# Altium schematic sheet 3.SchDoc
size 420 x 297 mm
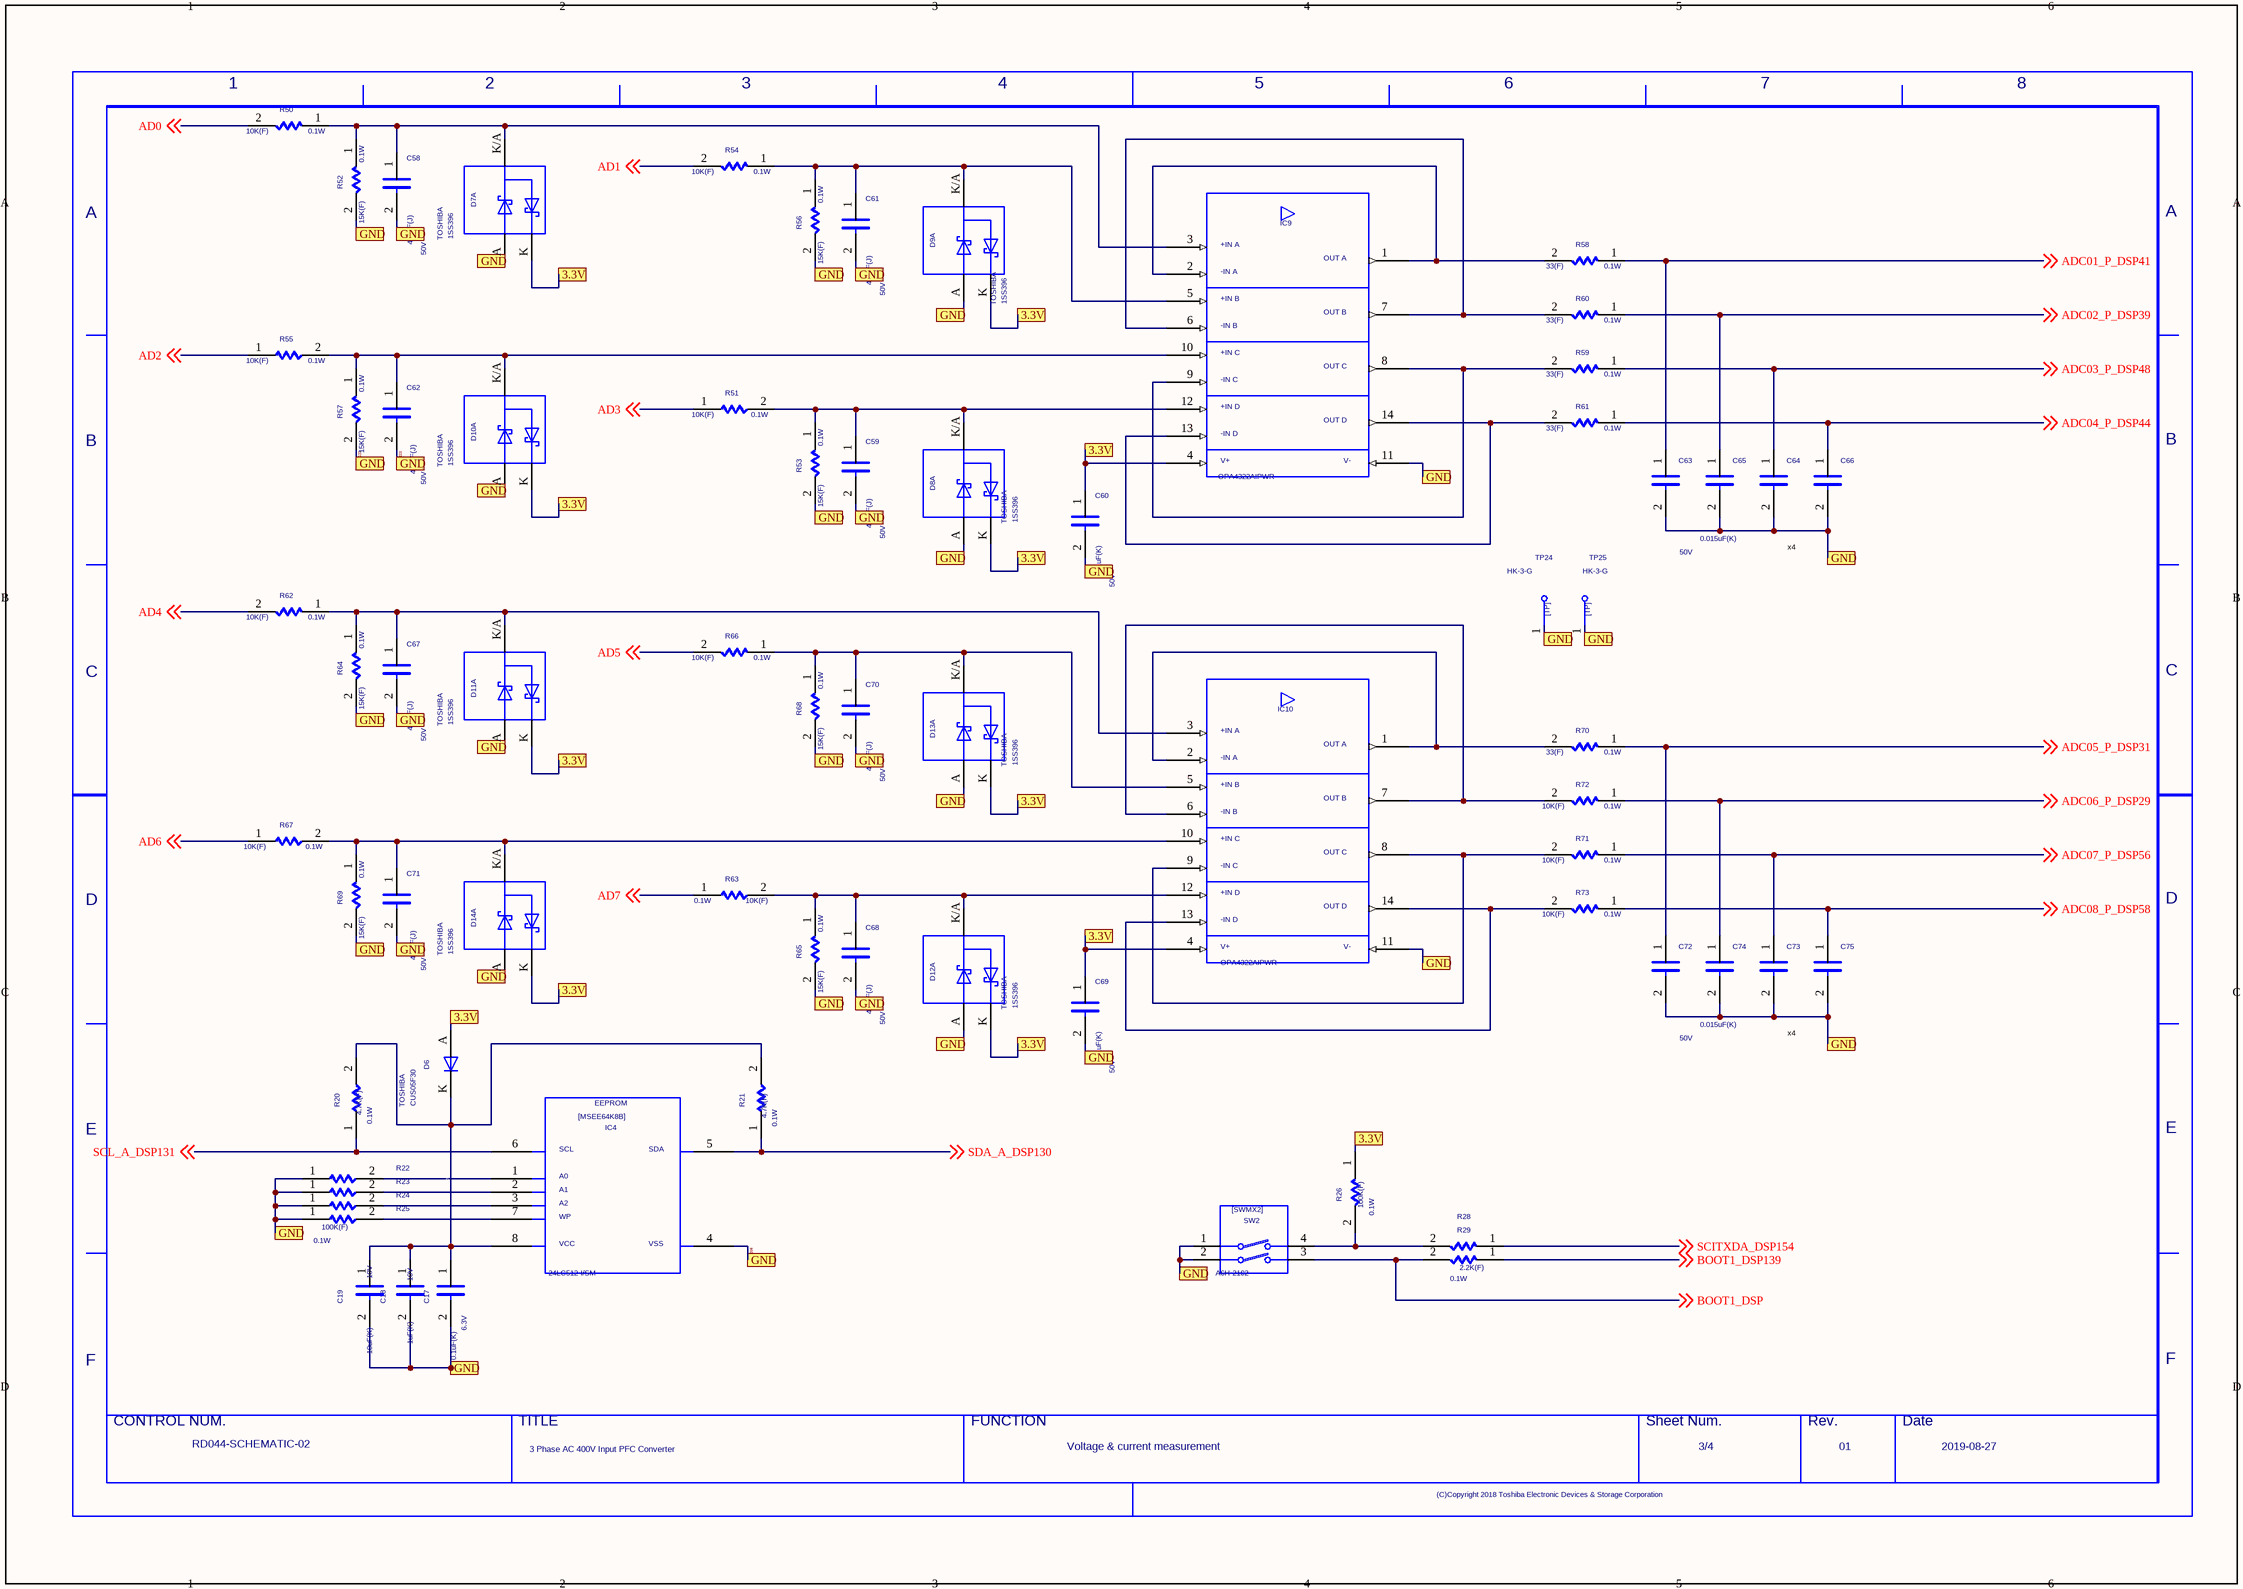
[diagram p0: 3.SchDoc]

## Parts
C17  VAL2: 6.3V  VAL1: 0.1uF(K)  (hidden comment: C)
C18  VAL2: 10V  VAL1: 1uF(K)  (hidden comment: C)
C19  VAL2: 10V  VAL1: 10uF(K)  (hidden comment: C)
C58  VAL2: 50V  VAL1: 470pF(J)  (hidden comment: C)
C59  VAL2: 50V  VAL1: 470pF(J)  (hidden comment: C)
C60  VAL2: 50V  VAL1: 0.1uF(K)  (hidden comment: C)
C61  VAL2: 50V  VAL1: 470pF(J)  (hidden comment: C)
C62  VAL2: 50V  VAL1: 470pF(J)  (hidden comment: C)
C63  VAL2: 50V  VAL1: 0.015uF(K)  (hidden comment: C)
C64  C  (value not drawn)
C65  C  (value not drawn)
C66  C  (value not drawn)
C67  VAL2: 50V  VAL1: 470pF(J)  (hidden comment: C)
C68  VAL2: 50V  VAL1: 470pF(J)  (hidden comment: C)
C69  VAL2: 50V  VAL1: 0.1uF(K)  (hidden comment: C)
C70  VAL2: 50V  VAL1: 470pF(J)  (hidden comment: C)
C71  VAL2: 50V  VAL1: 470pF(J)  (hidden comment: C)
C72  VAL2: 50V  VAL1: 0.015uF(K)  (hidden comment: C)
C73  C  (value not drawn)
C74  C  (value not drawn)
C75  C  (value not drawn)
D6  USERCOMPTEXT3: TOSHIBA  VAL3: CUS05F30  (hidden comment: DIODE)
D7  USERCOMPTEXT3: TOSHIBA  (hidden comment: 1SS396)  (part A of 3)
D8  USERCOMPTEXT3: TOSHIBA  (hidden comment: 1SS396)  (part A of 3)
D9  USERCOMPTEXT3: TOSHIBA  (hidden comment: 1SS396)  (part A of 3)
D10  USERCOMPTEXT3: TOSHIBA  (hidden comment: 1SS396)  (part A of 3)
D11  USERCOMPTEXT3: TOSHIBA  (hidden comment: 1SS396)  (part A of 3)
D12  USERCOMPTEXT3: TOSHIBA  (hidden comment: 1SS396)  (part A of 3)
D13  USERCOMPTEXT3: TOSHIBA  (hidden comment: 1SS396)  (part A of 3)
D14  USERCOMPTEXT3: TOSHIBA  (hidden comment: 1SS396)  (part A of 3)
IC4  VAL3: 24LC512-I/SM  (hidden comment: MSEE64K8B)
IC9  VAL3: OPA4322AIPWR  (hidden comment: OPA4322A)
IC10  VAL3: OPA4322AIPWR  (hidden comment: OPA4322A)
R20  VAL2: 0.1W  VAL1: 4.7K(F)  (hidden comment: R)
R21  VAL2: 0.1W  VAL1: 4.7K(F)  (hidden comment: R)
R22  R  (value not drawn)
R23  R  (value not drawn)
R24  R  (value not drawn)
R25  VAL2: 0.1W  VAL1: 100K(F)  (hidden comment: R)
R26  VAL2: 0.1W  VAL1: 100K(F)  (hidden comment: R)
R28  R  (value not drawn)
R29  VAL2: 0.1W  VAL1: 2.2K(F)  (hidden comment: R)
R50  VAL2: 0.1W  VAL1: 10K(F)  (hidden comment: R)
R51  VAL2: 0.1W  VAL1: 10K(F)  (hidden comment: R)
R52  VAL2: 0.1W  VAL1: 15K(F)  (hidden comment: R)
R53  VAL2: 0.1W  VAL1: 15K(F)  (hidden comment: R)
R54  VAL2: 0.1W  VAL1: 10K(F)  (hidden comment: R)
R55  VAL2: 0.1W  VAL1: 10K(F)  (hidden comment: R)
R56  VAL2: 0.1W  VAL1: 15K(F)  (hidden comment: R)
R57  VAL2: 0.1W  VAL1: 15K(F)  (hidden comment: R)
R58  VAL2: 0.1W  VAL1: 33(F)  (hidden comment: R)
R59  VAL2: 0.1W  VAL1: 33(F)  (hidden comment: R)
R60  VAL2: 0.1W  VAL1: 33(F)  (hidden comment: R)
R61  VAL2: 0.1W  VAL1: 33(F)  (hidden comment: R)
R62  VAL2: 0.1W  VAL1: 10K(F)  (hidden comment: R)
R63  VAL2: 0.1W  VAL1: 10K(F)  (hidden comment: R)
R64  VAL2: 0.1W  VAL1: 15K(F)  (hidden comment: R)
R65  VAL2: 0.1W  VAL1: 15K(F)  (hidden comment: R)
R66  VAL2: 0.1W  VAL1: 10K(F)  (hidden comment: R)
R67  VAL2: 0.1W  VAL1: 10K(F)  (hidden comment: R)
R68  VAL2: 0.1W  VAL1: 15K(F)  (hidden comment: R)
R69  VAL2: 0.1W  VAL1: 15K(F)  (hidden comment: R)
R70  VAL2: 0.1W  VAL1: 33(F)  (hidden comment: R)
R71  VAL2: 0.1W  VAL1: 10K(F)  (hidden comment: R)
R72  VAL2: 0.1W  VAL1: 10K(F)  (hidden comment: R)
R73  VAL2: 0.1W  VAL1: 10K(F)  (hidden comment: R)
SW2  VAL3: A6H-2102  (hidden comment: SWMX2)
TP24  VAL3: HK-3-G  (hidden comment: TP)
TP25  VAL3: HK-3-G  (hidden comment: TP)
U?  DATE: 2019-08-27  REVISION: 01  SHEETNUMBER: 3/4  FUNCTION: Voltage & current measurement  TITLE: 3 Phase AC 400V Input PFC Converter  DRAWINGNUMBER: RD044-SCHEMATIC-02  (hidden comment: WAKU_DEF100_2018)

## Ports
3.3V, GND

## Nets
3.3V: C60.1 C69.1 D6.A D7.K D8.K D9.K D10.K D11.K D12.K D13.K D14.K IC9.4 IC10.4 R26.1 ; port 3.3V
AD0: R50.2 ; off-sheet AD0
AD1: R54.2 ; off-sheet AD1
AD2: R55.1 ; off-sheet AD2
AD3: R51.1 ; off-sheet AD3
AD4: R62.2 ; off-sheet AD4
AD5: R66.2 ; off-sheet AD5
AD6: R67.1 ; off-sheet AD6
AD7: R63.1 ; off-sheet AD7
ADC01_P_DSP41: C63.1 R58.1 ; off-sheet ADC01_P_DSP41
ADC02_P_DSP39: C65.1 R60.1 ; off-sheet ADC02_P_DSP39
ADC03_P_DSP48: C64.1 R59.1 ; off-sheet ADC03_P_DSP48
ADC04_P_DSP44: C66.1 R61.1 ; off-sheet ADC04_P_DSP44
ADC05_P_DSP31: C72.1 R70.1 ; off-sheet ADC05_P_DSP31
ADC06_P_DSP29: C74.1 R72.1 ; off-sheet ADC06_P_DSP29
ADC07_P_DSP56: C73.1 R71.1 ; off-sheet ADC07_P_DSP56
ADC08_P_DSP58: C75.1 R73.1 ; off-sheet ADC08_P_DSP58
BOOT1_DSP: R29.2 SW2.3 ; off-sheet BOOT1_DSP
BOOT1_DSP139: R29.1 ; off-sheet BOOT1_DSP139
N16610346: C17.1 C18.1 C19.1 D6.K IC4.8 R20.2 R21.2
N16610376: IC4.1 R22.2
N16610420: IC4.2 R23.2
N16610428: IC4.7 R25.2
N16610486: IC4.3 R24.2
N16610930: R26.2 R28.2 SW2.4
N16624647: C59.1 D8.K/A IC9.12 R51.2 R53.1
N16624651: C58.1 D7.K/A IC9.3 R50.1 R52.1
N16624783: IC9.1 IC9.2 R58.2
N16624799: IC9.13 IC9.14 R61.2
N16625013: C61.1 D9.K/A IC9.5 R54.1 R56.1
N16625021: C62.1 D10.K/A IC9.10 R55.2 R57.1
N16625097: IC9.6 IC9.7 R60.2
N16625113: IC9.8 IC9.9 R59.2
N16625873: C67.1 D11.K/A IC10.3 R62.1 R64.1
N16626013: IC10.1 IC10.2 R70.2
N16626029: IC10.13 IC10.14 R73.2
N16626045: C68.1 D12.K/A IC10.12 R63.2 R65.1
N16626273: C70.1 D13.K/A IC10.5 R66.1 R68.1
N16626281: C71.1 D14.K/A IC10.10 R67.2 R69.1
N16626357: IC10.6 IC10.7 R72.2
N16626365: IC10.8 IC10.9 R71.2
SCITXDA_DSP154: R28.1 ; off-sheet SCITXDA_DSP154
SCL_A_DSP131: IC4.6 R20.1 ; off-sheet SCL_A_DSP131
SDA_A_DSP130: IC4.5 R21.1 ; off-sheet SDA_A_DSP130
SIG206: C17.2 C18.2 C19.2 C58.2 C59.2 C60.2 C61.2 C62.2 C63.2 C64.2 C65.2 C66.2 C67.2 C68.2 C69.2 C70.2 C71.2 C72.2 C73.2 C74.2 C75.2 D7.A D8.A D9.A D10.A D11.A D12.A D13.A D14.A IC4.4 IC9.11 IC10.11 R22.1 R23.1 R24.1 R25.1 R52.2 R53.2 R56.2 R57.2 R64.2 R65.2 R68.2 R69.2 SW2.1 SW2.2 TP24.1 TP25.1 ; port GND  [also labelled SIG222, SIG223]

## Notes on the sheet
- x4
- (in symbol MSEE64K8B) [MSEE64K8B]; SCL; SDA; A0; A1; A2; WP; VCC; VSS
- (in symbol OPA4322A) +IN A; OUT A; -IN A; +IN B; OUT B; -IN B; +IN C; OUT C; -IN C; +IN D; OUT D; -IN D; V+; V-
- (in symbol SWMX2) [SWMX2]
- (in symbol TP) [TP]
- (in symbol WAKU_DEF100_2018) 1; 3; 5; 6; 7; 8; A; B; C; D; E; F; CONTROL NUM.; TITLE; FUNCTION; Sheet Num.; Rev.; Date; (C)Copyright 2018 Toshiba Electronic Devices & Storage Corporation

## Library data of the parts
C17 = C: PARTNAME: C-GRM155R70J104KA01D; OriginalSymbolOrigin: (2540,7620); USERCOMPTEXT1: 1005; COMPONENTTYPE: 4; COMPONENTKIND: 108
C18 = C: PARTNAME: C-GRM188R71A105KA61D; OriginalSymbolOrigin: (2540,7620); USERCOMPTEXT1: 1608; COMPONENTTYPE: 4; COMPONENTKIND: 108
C19 = C: PARTNAME: C-GRM188R61A106KE69D; OriginalSymbolOrigin: (2540,7620); USERCOMPTEXT1: 1608; COMPONENTTYPE: 4; COMPONENTKIND: 108
C58 C59 C61 C62 C67 C68 C70 C71 = C: PARTNAME: C-GRM1885C1H471JA01D; OriginalSymbolOrigin: (2540,7620); USERCOMPTEXT1: 1608; COMPONENTTYPE: 4; COMPONENTKIND: 108
C60 C69 = C: PARTNAME: C-GRM188R71H104KA93D; OriginalSymbolOrigin: (2540,7620); USERCOMPTEXT1: 1608; COMPONENTTYPE: 4; COMPONENTKIND: 108
C63 C72 = C: PARTNAME: C-GRM188R11H153KA01D; OriginalSymbolOrigin: (2540,7620); USERCOMPTEXT1: 1608; COMPONENTTYPE: 4; COMPONENTKIND: 108
C64-C66 C73-C75 = C: PARTNAME: C-GRM188R11H153KA01D; OriginalSymbolOrigin: (2540,7620); USERCOMPTEXT1: 1608; VAL2: 50V; VAL1: 0.015uF(K); COMPONENTTYPE: 4; COMPONENTKIND: 108
D6 = DIODE: PARTNAME: D-CUS05F30; SAVEAREA0: -1337,-97,13924,7829; SAVECOUNT: 4; TIME: 14:49:55; UPDATEUSER: cae; UPDATETIME: 13:41:08; OriginalSymbolOrigin: (5080,5080); COMPONENTTYPE: 4; COMPONENTKIND: 103; AUTHOR: ikeda-k; DATE: 2003/02/07; UPDATEDATE: 2019/07/08
D7-D14 = 1SS396: PARTNAME: D-1SS396_AK; SAVECOUNT: 7; SAVEAREA0: -5465,-437,27678,21425; TIME: 18:51:12; UPDATEUSER: cae; UPDATETIME: 10:39:29; OriginalSymbolOrigin: (5080,17780); COMPONENTTYPE: 4; COMPONENTKIND: 103; AUTHOR: sato-yr; DATE: 2002/11/26; UPDATEDATE: 2019/08/02; VAL3: 1SS396
IC4 = MSEE64K8B: PARTNAME: IC-24LC512-I_SM; OUMEPARTTYPE: IC; SAVECOUNT: 8; SAVEAREA0: -9998,-458,55119,39162; TIME: 10:18:07; UPDATEUSER: 19990028; UPDATETIME: 09:15:23; OriginalSymbolOrigin: (7620,35560); MAXGCOUNT: 1; ACCESSTIME: 0; OUMEMAKER: MCT マイクロチップテクノロジー; MOUNTINGFORMSMD: SMD; FNLEADFREETHET1GT2GMCTH1: N_N_N; OUMECLASSIFICATION: メモリ; ADSCNVFLAG: ON; MEMORYCAPACITY: 512K; CDMASTERCADCELG: I8112C; KIND: EEPROM; COMPONENTTYPE: 4; COMPONENTKIND: 101; AUTHOR: 19910145; DATE: 2008/10/07; UPDATEDATE: 2011/01/31; GCOUNT: 1; MAXCLOCKFREQ: 0; OUMEMAKERKATAMEI: 24LC512-I/SM; VAL1: 24LC512-I/SM
IC9 IC10 = OPA4322A: PARTNAME: IC-OPA4322AIPWR; SAVECOUNT: 28; SAVEAREA0: -34439,-609,80338,59004; TIME: 15:40:02; UPDATEUSER: cae; UPDATETIME: 16:49:13; OriginalSymbolOrigin: (7620,55880); COMPONENTTYPE: 4; COMPONENTKIND: 101; AUTHOR: Administrator; DATE: 2002/05/27; UPDATEDATE: 2019/06/25
R20 R21 = R: PARTNAME: R-ERJ3EKF4701V; OriginalSymbolOrigin: (5080,5080); USERCOMPTEXT1: 1608; COMPONENTTYPE: 4; COMPONENTKIND: 105
R22-R24 = R: PARTNAME: R-ERJ3EKF1003V; OriginalSymbolOrigin: (5080,5080); USERCOMPTEXT1: 1608; VAL2: 0.1W; VAL1: 100K(F); COMPONENTTYPE: 4; COMPONENTKIND: 105
R25 R26 = R: PARTNAME: R-ERJ3EKF1003V; OriginalSymbolOrigin: (5080,5080); USERCOMPTEXT1: 1608; COMPONENTTYPE: 4; COMPONENTKIND: 105
R28 = R: PARTNAME: R-ERJ3EKF2201V; OriginalSymbolOrigin: (5080,5080); USERCOMPTEXT1: 1608; VAL2: 0.1W; VAL1: 2.2K(F); COMPONENTTYPE: 4; COMPONENTKIND: 105
R29 = R: PARTNAME: R-ERJ3EKF2201V; OriginalSymbolOrigin: (5080,5080); USERCOMPTEXT1: 1608; COMPONENTTYPE: 4; COMPONENTKIND: 105
R50 R51 R54 R55 R62 R63 R66 R67 = R: PARTNAME: R-ERJ3EKF1002V; OriginalSymbolOrigin: (5080,5080); USERCOMPTEXT1: 1608; COMPONENTTYPE: 4; COMPONENTKIND: 105
R52 R53 R56 R57 R64 R65 R68 R69 = R: PARTNAME: R-ERJ3EKF1502V; OriginalSymbolOrigin: (5080,5080); USERCOMPTEXT1: 1608; COMPONENTTYPE: 4; COMPONENTKIND: 105
R58-R61 R70-R73 = R: PARTNAME: R-ERJ3EKF33R0V; OriginalSymbolOrigin: (5080,5080); USERCOMPTEXT1: 1608; COMPONENTTYPE: 4; COMPONENTKIND: 105
SW2 = SWMX2: PARTNAME: SW-A6H-2102; OriginalSymbolOrigin: (5080,15240); COMPONENTTYPE: 4; COMPONENTKIND: 115
TP24 TP25 = TP: PARTNAME: TP-HK-3-G; TIME: 16:12:21; UPDATEUSER: fukuda-y; UPDATETIME: 16:18:11; SAVECOUNT: 2; SAVEAREA0: -242,-92,12810,7836; OriginalSymbolOrigin: (0,7620); COMPONENTTYPE: 4; COMPONENTKIND: 128; AUTHOR: fukuda-y; DATE: 2006/10/04; UPDATEDATE: 2006/10/04
U? = WAKU_DEF100_2018: PLOTTIME: HH:MM; SAVEAREA0: -45080,-4508,463680,304612; TIME: 13:54:34; UPDATEUSER: t5459927; UPDATETIME: 12:04:35; SAVECOUNT: 4; OriginalSymbolOrigin: (10160,284480); COMPONENTTYPE: 2; COMPONENTKIND: 0; PLOTDATE: YYYY.MM.DD; AUTHOR: cae; UPDATEDATE: 2019/08/29